# EAGLE design ESP12_Dev_2Layer (EAGLE 7.2.0)
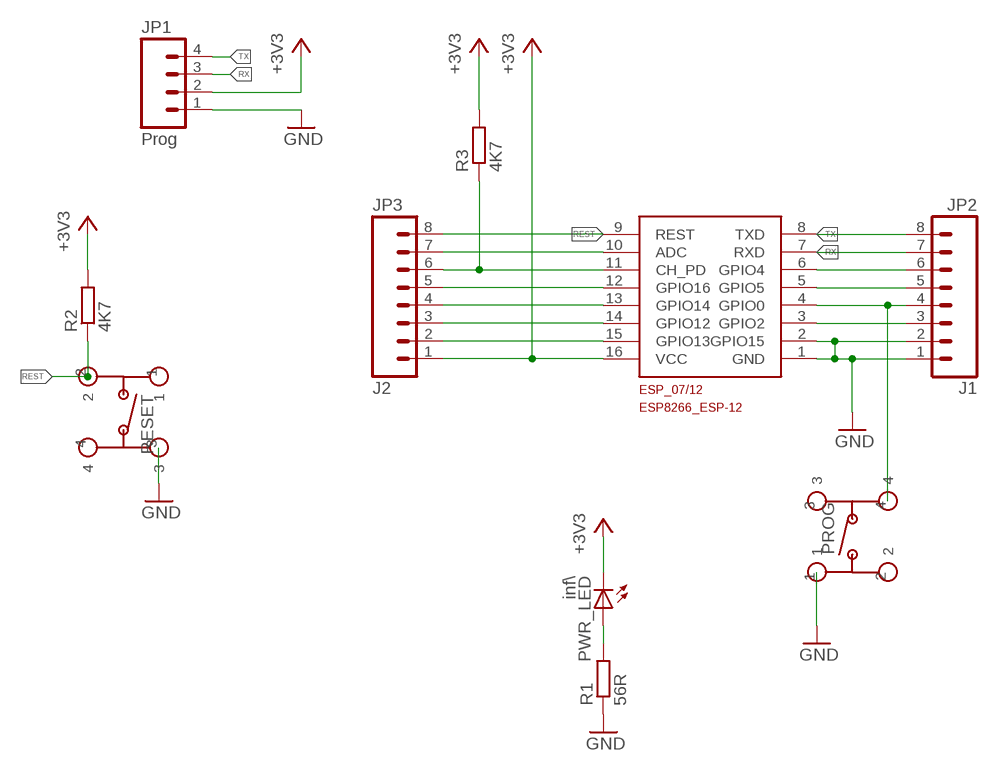
[diagram p0: schematic, sheet 1]

## Parts
ESP_07/12  ESP8266_ESP-12  [ESP8266-ESP12]
JP1  Prog  M04LOCK  [1X04_LOCK]
JP2  J1  M08LOCK  [1X08_LOCK]
JP3  J2  M08LOCK  [1X08_LOCK]
PROG  TACTILE-SWITCH-SMD  [TACTILE-SWITCH-SMD]
PWR_LED  inf\  LEDCHIPLED_0805  [CHIPLED_0805]
R1  56R  R-EU_R0805  [R0805]
R2  4K7  R-EU_R0805  [R0805]
R3  4K7  R-EU_R0805  [R0805]
RESET  TACTILE-SWITCH-SMD  [TACTILE-SWITCH-SMD]

## Nets
+3V3: ESP_07/12.16(VCC) JP1.2 JP3.1 PWR_LED.C R2.2 R3.2
ADC: ESP_07/12.10(ADC) JP3.7
CH_PD: ESP_07/12.11(CH_PD) JP3.6 R3.1
GND: ESP_07/12.1(GND) ESP_07/12.2(GPIO15) JP1.1 JP2.1 JP2.2 PROG.1 R1.1 RESET.3
GPIO0: ESP_07/12.4(GPIO0) JP2.4 PROG.4
GPIO2: ESP_07/12.3(GPIO2) JP2.3
GPIO4: ESP_07/12.6(GPIO4) JP2.6
GPIO5: ESP_07/12.5(GPIO5) JP2.5
GPIO12: ESP_07/12.14(GPIO12) JP3.3
GPIO13: ESP_07/12.15(GPIO13) JP3.2
GPIO14: ESP_07/12.13(GPIO14) JP3.4
GPIO16: ESP_07/12.12(GPIO16) JP3.5
N$1: PWR_LED.A R1.2
REST: ESP_07/12.9(REST) JP3.8 R2.1 RESET.2
RX: ESP_07/12.7(RXD) JP1.3 JP2.7
TX: ESP_07/12.8(TXD) JP1.4 JP2.8
Unconnected: PROG.2 PROG.3 RESET.1 RESET.4

## Library data of the parts
ESP_07/12 = ESP8266-ESP12:ESP8266_ESP-12: ESP8266 ESP-12 Discussion about pins here: http://www.esp8266.com/viewtopic.php?f=13&t=1429
JP1 = SparkFun-Connectors:M04: Header 4 Standard 4-pin 0.1" header. Use with straight break away headers (SKU : PRT-00116), right angle break away headers (PRT-00553), swiss pins (PRT-00743), machine pins (PRT-00117), and female headers (PRT-00115). Molex polarized connector foot print use with SKU : PRT-08231 with associated crimp pins and housings. 1MM SMD Version SKU: PRT-10208
JP2 JP3 = SparkFun-Connectors:M08: Header 8 Standard 8-pin 0.1" header. Use with straight break away headers (SKU : PRT-00116), right angle break away headers (PRT-00553), swiss pins (PRT-00743), machine pins (PRT-00117), and female headers (PRT-00115).
PROG RESET = Gwa's Parts:TACTILE-SWITCH-SMD
PWR_LED = led:LED: LED OSRAM: - CHIPLED LG R971, LG N971, LY N971, LG Q971, LY Q971, LO R971, LY R971 LH N974, LH R974 LS Q976, LO Q976, LY Q976 LO Q996 - Hyper CHIPLED LW Q18S LB Q993, LB Q99A, LB R99A - SideLED LS A670, LO A670, LY A670, LG A670, LP A670 LB A673, LV A673, LT A673, LW A673 LH A674 LY A675 LS A676, LA A676, LO A676, LY A676, LW A676 LS A679, LY A679, LG A679 - Hyper Micro SIDELED® LS Y876, LA Y876, LO Y876, LY Y876 LT Y87S - SmartLED LW L88C, LW L88S LB L89C, LB L89S, LG L890 LS L89K, LO L89K, LY L89K LS L896, LA L896, LO L896, LY L896 - TOPLED LS T670, LO T670, LY T670, LG T670, LP T670 LSG T670, LSP T670, LSY T670, LOP T670, LYG T670 LG T671, LOG T671, LSG T671 LB T673, LV T673, LT T673, LW T673 LH T674 LS T676, LA T676, LO T676, LY T676, LB T676, LH T676, LSB T676, LW T676 LB T67C, LV T67C, LT T67C, LS T67K, LO T67K, LY T67K, LW E67C LS E67B, LA E67B, LO E67B, LY E67B, LB E67C, LV E67C, LT E67C LW T67C LS T679, LY T679, LG T679 LS T770, LO T770, LY T770, LG T770, LP T770 LB T773, LV T773, LT T773, LW T773 LH T774 LS E675, LA E675, LY E675, LS T675 LS T776, LA T776, LO T776, LY T776, LB T776 LHGB T686 LT T68C, LB T68C - Hyper Mini TOPLED® LB M676 - Mini TOPLED Santana® LG M470 LS M47K, LO M47K, LY M47K Source: http://www.osram.convergy.de LUXEON: - LUMILED® LXK2-PW12-R00, LXK2-PW12-S00, LXK2-PW14-U00, LXK2-PW14-V00 LXK2-PM12-R00, LXK2-PM12-S00, LXK2-PM14-U00 LXK2-PE12-Q00, LXK2-PE12-R00, LXK2-PE12-S00, LXK2-PE14-T00, LXK2-PE14-U00 LXK2-PB12-K00, LXK2-PB12-L00, LXK2-PB12-M00, LXK2-PB14-N00, LXK2-PB14-P00, LXK2-PB14-Q00 LXK2-PR12-L00, LXK2-PR12-M00, LXK2-PR14-Q00, LXK2-PR14-R00 LXK2-PD12-Q00, LXK2-PD12-R00, LXK2-PD12-S00 LXK2-PH12-R00, LXK2-PH12-S00 LXK2-PL12-P00, LXK2-PL12-Q00, LXK2-PL12-R00 Source: www.luxeon.com KINGBRIGHT: KA-3528ASYC Source: www.kingbright.com
R1-R3 = resistor:R-EU_: RESISTOR, European symbol

## Board
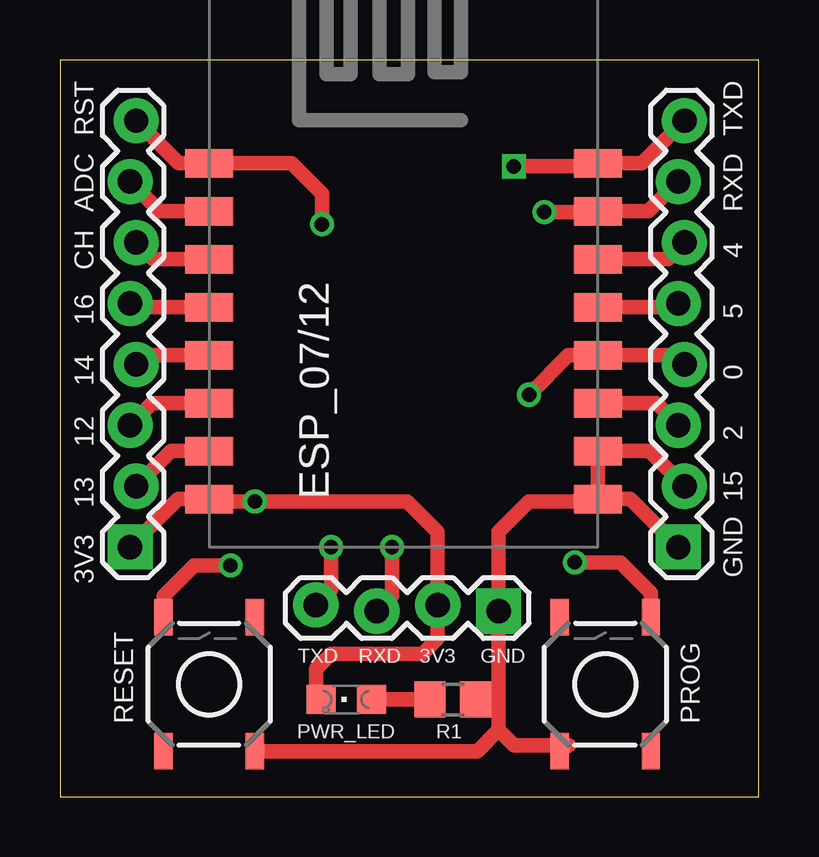
[diagram p1: board, top side]
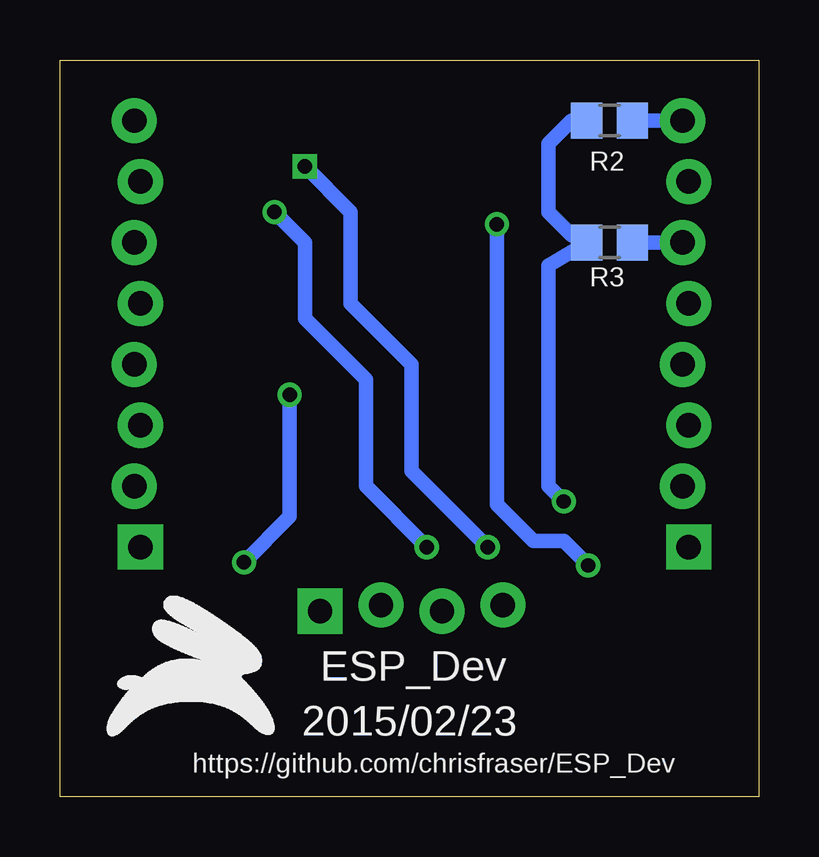
[diagram p2: board, bottom side, seen from below]

Size 29.13 x 30.72 mm. Coordinates in mm from the lower left corner, seen from the top.
Outline: 0,0 29.13,0 29.13,30.72 0,30.72 0,0
Copper layers (1*16): Top 0.035mm / dielectric 1.5mm / Bottom 0.035mm
Design rules "default *": minimum track width 0.15mm, minimum drill 0.4mm, track to track 8mil, track to pad 8mil, pad to pad 8mil, via to via 8mil, smd to smd 8mil, copper to edge 40mil, drill to drill 8mil, minimum pad ring 10mil, minimum via ring 8mil, stop-mask expansion 4mil, vias tented up to drill 0mil, thermal gap 10mil

### Footprints (pad centres in the part's own frame; a part is rotated, then mirrored left to right if it is on the bottom)
ESP8266-ESP12 = smd 2 x 1.2: 1 16.2,2; 2 16.2,4; 3 16.2,6; 4 16.2,8; 5 16.2,10; 6 16.2,12; 7 16.2,14; 8 16.2,16; 9 0,16; 10 0,14; 11 0,12; 12 0,10; 13 0,8; 14 0,6; 15 0,4; 16 0,2
1X04_LOCK = drill 1.016 pad 1.88 square: 1 0,0.127 | drill 1.016 pad 1.88: 2 2.54,-0.127; 3 5.08,0.127; 4 7.62,-0.127
1X08_LOCK = drill 1.016 pad 1.88 square: 1 0,0.127 | drill 1.016 pad 1.88: 2 2.54,-0.127; 3 5.08,0.127; 4 7.62,-0.127; 5 10.16,0.127; 6 12.7,-0.127; 7 15.24,0.127; 8 17.78,-0.127
TACTILE-SWITCH-SMD = smd 1.524 x 0.762: 1 -2.794,1.905; 2 2.794,1.905; 3 -2.794,-1.905; 4 2.794,-1.905
CHIPLED_0805 = smd 1.2 x 1.2: A 0,-1.05; C 0,1.05
R0805 = smd 1.3 x 1.5: 1 -0.95,0; 2 0.95,0

### Placement (x,y rotation side)
ESP_07/12  6.22,10.41 0 top
JP1  18.29,7.87 180 top
JP2  25.91,10.41 90 top
JP3  3.05,10.41 90 top
PROG  22.73,4.7 90 top
PWR_LED  11.94,4.06 90 top
R1  16.38,4.06 180 top
R2  6.22,28.19 180 bottom
R3  6.22,23.11 180 bottom
RESET  6.22,4.7 90 top
U$1  [GWAJA-LOGO-PLACE]  27.18,2.54 0 bottom

### Tracks (layer width: path | path; a pad name or v marks a point on that pad's centre or on a via)
+3V3  (via drill 0.6)
  Top 0.61: JP3.1 4.92,12.41 ESP_07/12.16 6.32,12.32 v8.13,12.32 14.48,12.32 15.75,11.05 JP1.2 15.75,6.6 15.11,5.97 11.3,5.97 10.67,5.33 10.67,4.28 PWR_LED.C
  Bottom 0.61: R2.2 7.81,28.19 8.76,27.24 8.76,24.38 7.81,23.43 R3.2 8.76,22.16 8.76,12.95 v8.13,12.32
ADC
  Top 0.61: ESP_07/12.10 4.16,24.41 JP3.7
CH_PD
  Top 0.61: ESP_07/12.11 3.88,22.41 JP3.6
  Bottom 0.61: R3.1 JP3.6
GND
  Top 0.61: ESP_07/12.1 23.78,12.41 JP2.1 | JP2.2 24.58,14.41 ESP_07/12.2 ESP_07/12.1 | ESP_07/12.1 22.33,12.32 19.56,12.32 18.29,11.05 JP1.1 18.29,4.06 | 18.29,4.06 R1.1 | 18.29,4.06 18.29,2.79 | 18.29,2.79 18.92,2.16 21.21,2.16 PROG.1 | RESET.3 17.4,1.91 18.29,2.79
GPIO0  (via drill 0.6)
  Top 0.61: JP2.4 25.66,18.41 ESP_07/12.4 21.21,18.41 v19.56,16.76 | PROG.4 24.64,8.51 23.37,9.78 v21.46,9.78
  Bottom 0.61: v21.46,9.78 19.56,11.68 v19.56,16.76
GPIO2
  Top 0.61: ESP_07/12.3 24.86,16.41 JP2.3
GPIO4
  Top 0.61: ESP_07/12.6 25.34,22.41 JP2.6
GPIO5
  Top 0.61: ESP_07/12.5 25.62,20.41 JP2.5
GPIO12
  Top 0.61: ESP_07/12.14 3.84,16.41 JP3.3
GPIO13
  Top 0.61: ESP_07/12.15 4.64,14.41 JP3.2
GPIO14
  Top 0.61: ESP_07/12.13 3.55,18.41 JP3.4
GPIO16
  Top 0.61: ESP_07/12.12 3.08,20.41 JP3.5
N$1
  Top 0.61: PWR_LED.A R1.2
REST  (via drill 0.6)
  Top 0.61: JP3.8 4.96,26.41 ESP_07/12.9 9.65,26.42 10.92,25.15 v10.92,23.88 | RESET.2 4.32,8.38 5.59,9.65 v7.11,9.65
  Bottom 0.61: v7.11,9.65 8.13,10.67 9.4,10.67 10.92,12.19 v10.92,23.88 | R2.1 JP3.8
RX  (via drill 0.6)
  Top 0.61: JP2.7 24.54,24.41 ESP_07/12.7 22.39,24.38 v20.19,24.38 | v13.84,10.41 13.84,8.38 JP1.3
  Bottom 0.61: v20.19,24.38 18.92,23.11 18.92,19.94 16.38,17.4 16.38,12.95 v13.84,10.41
TX  (via drill 0.6)
  Top 0.61: JP2.8 24.26,26.41 ESP_07/12.8 22.3,26.29 v18.92,26.29 | v11.3,10.41 11.3,8.64 JP1.4
  Bottom 0.61: v18.92,26.29 17.02,24.38 17.02,20.57 14.48,18.03 14.48,13.59 v11.3,10.41

### Text on the board
tPlace: RST | TXD | ADC | RXD | 4 | CH | 16 | 5 | 14 | 0 | 12 | 2 | 13 | 15 | GND | 3V3 | TXD | RXD | 3V3 | GND | RESET | PROG
bPlace: ESP_Dev | 2015/02/23 | https://github.com/chrisfraser/ESP_Dev